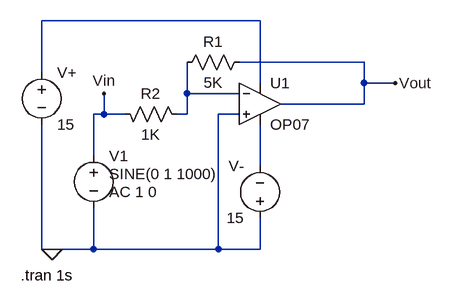
[diagram p0: schematic OpAmp2.asc]
OpAmp2.asc, the LTspice schematic file:
Version 4
SHEET 1 880 680
WIRE 320 -16 -16 -16
WIRE 480 48 288 48
WIRE -16 64 -16 -16
WIRE 320 80 320 -16
WIRE 480 80 480 48
WIRE 528 80 480 80
WIRE 208 96 208 48
WIRE 288 96 208 96
WIRE 480 112 480 80
WIRE 480 112 352 112
WIRE 80 128 80 96
WIRE 80 128 64 128
WIRE 112 128 80 128
WIRE 208 128 208 96
WIRE 208 128 192 128
WIRE 288 128 256 128
WIRE 64 192 64 128
WIRE 320 208 320 144
WIRE -16 336 -16 144
WIRE 0 336 -16 336
WIRE 64 336 64 272
WIRE 64 336 0 336
WIRE 256 336 256 128
WIRE 256 336 64 336
WIRE 320 336 320 288
WIRE 320 336 256 336
FLAG 528 80 Vout
FLAG 80 96 Vin
FLAG 0 336 0
SYMBOL voltage -16 48 R0
WINDOW 123 0 0 Left 0
WINDOW 39 0 0 Left 0
SYMATTR InstName V+
SYMATTR Value 15
SYMBOL voltage 320 304 R180
WINDOW 0 24 96 Left 2
WINDOW 3 24 16 Left 2
WINDOW 123 0 0 Left 0
WINDOW 39 0 0 Left 0
SYMATTR InstName V-
SYMATTR Value 15
SYMBOL voltage 64 176 R0
WINDOW 3 24 44 Left 2
WINDOW 123 24 72 Left 2
WINDOW 39 0 0 Left 0
SYMATTR Value SINE(0 1 1000)
SYMATTR Value2 AC 1 0
SYMATTR InstName V1
SYMBOL res 304 32 R90
WINDOW 0 0 56 VBottom 2
WINDOW 3 32 56 VTop 2
SYMATTR InstName R1
SYMATTR Value 5K
SYMBOL OpAmps\\OP07 320 48 R0
SYMATTR InstName U1
SYMBOL res 96 112 M90
WINDOW 0 0 56 VBottom 2
WINDOW 3 32 56 VTop 2
SYMATTR InstName R2
SYMATTR Value 1K
TEXT -48 376 Left 2 !.tran 1s

The netlist it stands for:
* OpAmp2.asc
V+ N001 0 15
V- 0 N003 15
V1 Vin 0 SINE(0 1 1000) AC 1 0
R1 Vout N002 5K
XU1 0 N002 N001 N003 Vout LT1001  ; OP07, pins In+ In- V+ V- OUT
R2 Vin N002 1K
.tran 1s
.lib LTC.lib
.backanno
.end